# EasyEDA Pro project PCIE拆分卡.epro, board PCB1
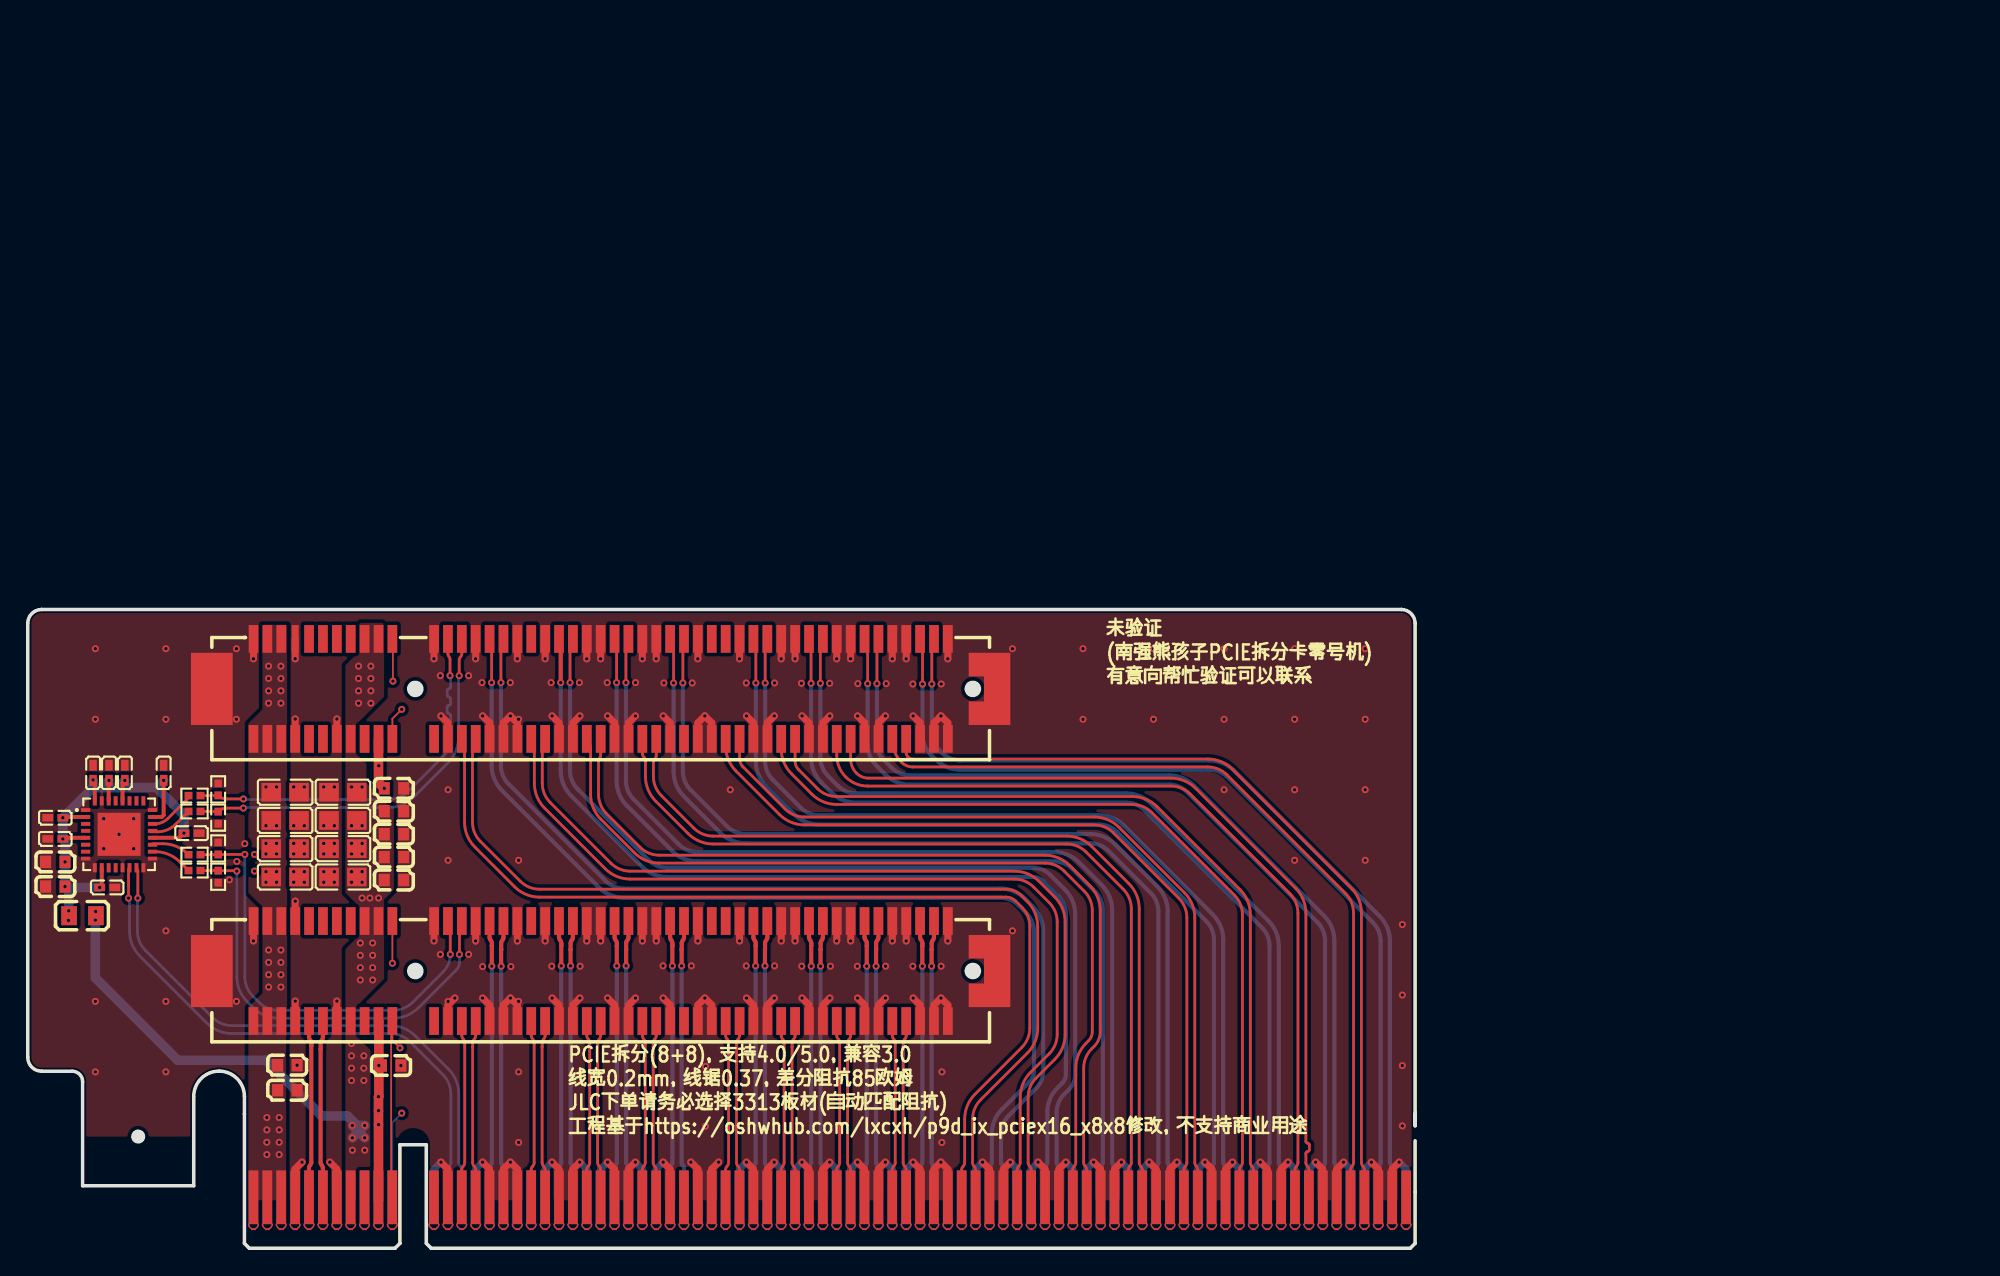
[diagram p4: board, top side]
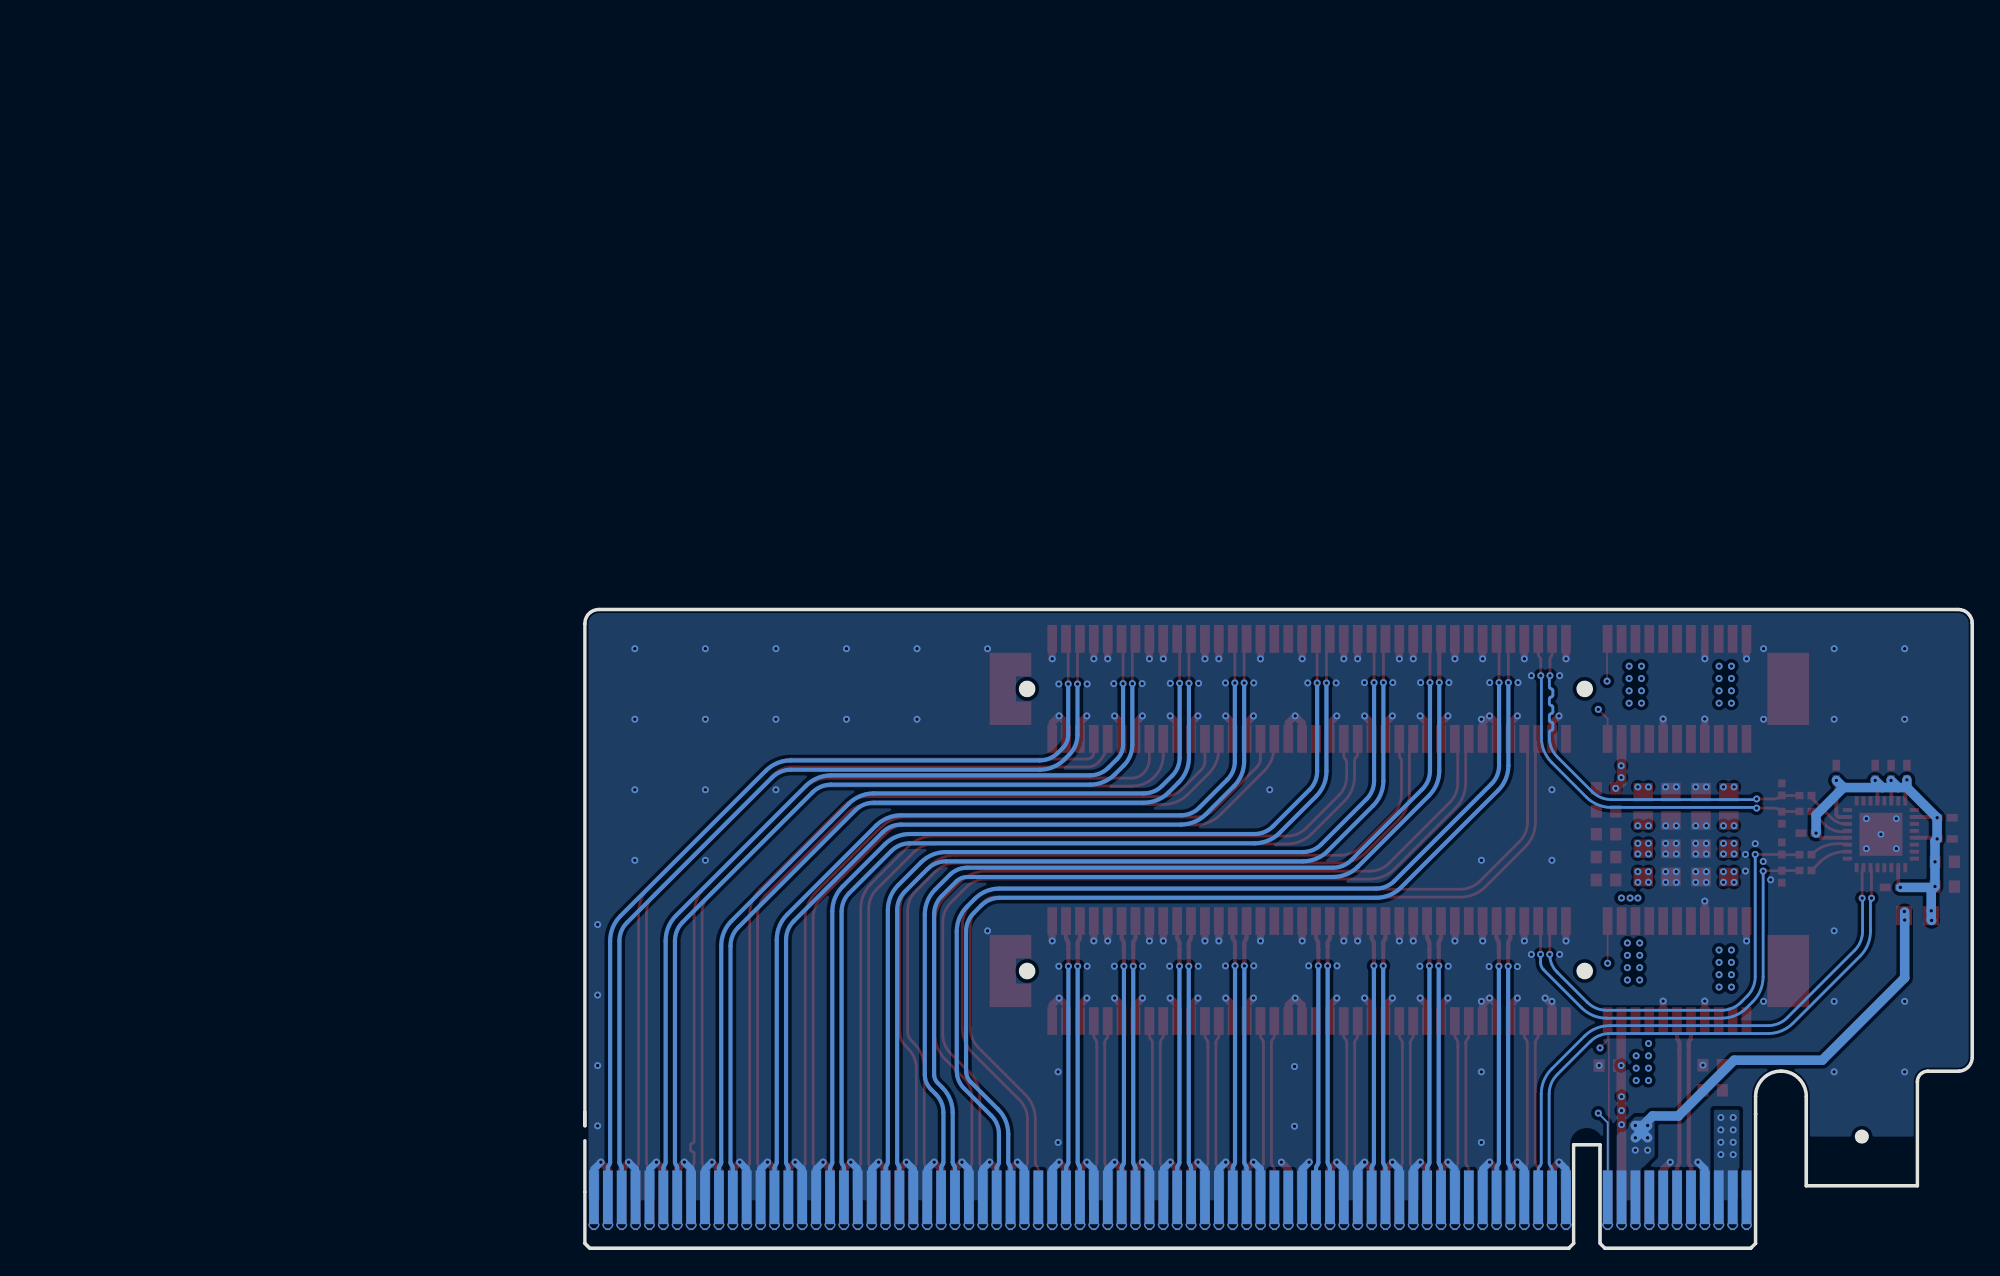
[diagram p5: board, bottom side, seen from below]

Outline 99.9 x 46.01 mm; copper layers: Top Layer, Inner1, Inner2, Bottom Layer. Coordinates in mm from the lower left corner of the outline.
Outline path: 15.6,10.93 arc(15.07,12.22) 13.78,12.76 arc(12.48,12.22) 11.95,10.93 11.95,4.5 3.95,4.5 3.95,12 arc(3.73,12.53) 3.2,12.75 1,12.75 arc(0.29,13.04) 0,13.75 0,45.01 arc(0.29,45.71) 1,46.01 98.9,46.01 arc(99.61,45.71) 99.9,45.01 99.9,8.82 99.9,9.77
Stack: Top Layer 0.035mm 外层铜厚1oz / Dielectric1 0.2104mm 7628 RC49% 8.6mil / Inner1 0.0152mm 内层铜厚 / Dielectric2 1.065mm 1.1mm H/HOZ 含铜 / Inner2 0.0152mm 内层铜厚 / Dielectric3 0.2104mm 7628 RC49% 8.6mil / Bottom Layer 0.035mm 外层铜厚1oz

## Design rules (mm)
net SMCLK: DP38
net SMDAT: DP38
net PE0_B0+: DP6
net PE0_B0-: DP6
net PE0_B1+: DP7
net PE0_B1-: DP7
net PE0_B2+: DP8
net PE0_B2-: DP8
net PE0_B3+: DP9
net PE0_B3-: DP9
net PE0_B4+: DP10
net PE0_B4-: DP10
net PE0_B5+: DP11
net PE0_B5-: DP11
net PE0_B6+: DP12
net PE0_B6-: DP12
net PE0_B7+: DP13
net PE0_B7-: DP13
net PE1_B0+: DP15
net PE1_B0-: DP15
net PE1_B1+: DP16
net PE1_B1-: DP16
net PE1_B2+: DP17
net PE1_B2-: DP17
net PE1_B3+: DP18
net PE1_B3-: DP18
net PE1_B4+: DP19
net PE1_B4-: DP19
net PE1_B5+: DP20
net PE1_B5-: DP20
net PE1_B6+: DP21
net PE1_B6-: DP21
net PE1_B7+: DP22
net PE1_B7-: DP22
net PE0_A3+: DP33
net PE0_A7-: DP37
net PE0_A6-: DP36
net PE0_A5-: DP35
net PE0_A5+: DP35
net PE0_A4+: DP34
net PE0_A4-: DP34
net PE0_A3-: DP33
net PE0_A7+: DP37
net PE0_A6+: DP36
net PE1_A0+: DP23
net PE0_A2+: DP32
net PE0_A2-: DP32
net PE0_A1-: DP31
net PE0_A1+: DP31
net REFCLK+: DP1
net REFCLK-: DP1
net PE0_A0-: DP14
net PE0_A0+: DP14
net PE1_A5-: DP28
net PE1_A5+: DP28
net PE1_A1-: DP24
net PE1_A0-: DP23
net PE1_A2+: DP25
net PE1_A2-: DP25
net PE1_A1+: DP24
net PE1_A3+: DP26
net PE1_A3-: DP26
net PE1_A4+: DP27
net PE1_A4-: DP27
net PE1_A6-: DP29
net PE1_A7-: DP30
net PE1_A7+: DP30
net PE1_A6+: DP29
net $2N1174: DP3
net $2N1173: DP3
net $2N1172: DP2
net PE1_CLK-: DP5
net PE1_CLK+: DP5
net PE0_CLK-: DP4
net PE0_CLK+: DP4
net $2N8038: DP2
template: 自定义配置
spacing copperThickness1oz (default): track to track 0.102, other pairs 0.152 to 0.3
spacing copperThickness2oz: track to track 0.203, other pairs 0.152 to 0.3
track width copperThickness1oz (default): min 0.127, default 0.254, max 2.54
track width copperThickness2oz: min 0.203, default 0.254, max 2.54
differential pair PCIE4.0 (default): width min 0.2, default 0.2, max 2.54; gap min 0.37, default 0.37
via viaSize (default): diameter min 0.508, default 0.508, max 10; hole min 0.254, default 0.254, max 6.299

## Placement (name value [footprint] x y rotation side)
C40  22uF  [C0805]  18.53 26.74 0 top
C41  22uF  [C0805]  18.53 28.78 0 top
C45  22uF  [C0805]  22.7 30.81 180 top
C46  22uF  [C0805]  22.7 32.84 180 top
C53  1uF  [C0603]  1.98 27.83 180 top
C54  10uF  [C0603]  1.98 26.05 180 top
C67  100nF  [C0402]  11.79 29.9 0 top
C68  100nF  [C0402]  1.98 29.48 180 top
C69  100nF  [C0402]  5.85 34.24 90 top
C70  100nF  [C0402]  4.7 34.24 270 top
C71  100nF  [C0402]  1.98 31 0 top
C72  100nF  [C0402]  9.78 34.24 90 top
C73  100nF  [C0402]  5.72 25.99 180 top
C74  100nF  [C0402]  6.99 34.24 270 top
C77  100nF  [C0603]  26.37 28.17 0 top
C78  100nF  [C0603]  26.37 31.47 0 top
C79  100nF  [C0603]  26.37 33.12 0 top
C80  22uF  [C0805]  18.53 30.81 0 top
C81  22uF  [C0805]  18.53 32.84 0 top
C82  22uF  [C0805]  22.7 28.78 180 top
C83  22uF  [C0805]  22.7 26.74 180 top
C84  100nF  [C0603]  18.69 11.38 0 top
C85  100nF  [C0603]  18.69 13.18 0 top
C86  100nF  [C0603]  26.37 29.82 0 top
C87  100nF  [C0603]  26.37 26.52 0 top
C88  100nF  [C0603]  26.17 13.16 0 top
CEMX16_GOLD1  -  [PCIEX16_GOLD]  83.57 47.45 0 top
CN4  3113-112T  [CONN-SMD_98P-P1.00-V_3133]  41.25 19.97 0 top
CN5  3113-112T  [conn-smd_98p-p1.00-v_3133]  41.25 40.29 0 top
L3  -  [L0805]  3.94 23.95 0 top
R37  49.9Ω  [R0402]  13.71 33.05 270 top
R38  49.9Ω  [R0402]  13.71 31.01 90 top
R39  49.9Ω  [R0402]  13.71 28.79 270 top
R40  49.9Ω  [R0402]  13.71 26.76 90 top
R45  33Ω  [R0402]  12.01 32.6 0 top
R46  33Ω  [R0402]  12.01 31.46 0 top
R47  33Ω  [R0402]  12.01 28.35 0 top
R48  33Ω  [R0402]  12.01 27.2 0 top
U1  -  [WQFN-32_L5.0-W5.0-P0.50-BL-EP]  6.58 29.81 270 top

## Footprints (pads in the part's own frame, mm; a bottom-side part is the same pattern mirrored in y, then rotated)
C0402
  rect 0.79x0.54 smd: 1(-0.545,0) 2(0.545,0)
C0603
  rect 0.8x0.9 smd: 1(-0.7,0) 2(0.7,0)
C0805
  rect 1.41x1.35 smd: 1(-1,0) 2(1,0)
CONN-SMD_98P-P1.00-V_3133
  rect 3x5.2 smd: 50(-28,0)
  custom 3x5.2 smd: 52(28.55,0)
  rect 0.7x2 smd: A1(-25,3.6) A2(-24,3.6) A3(-23,3.6) A4(-22,3.6) A5(-21,3.6) A6(-20,3.6) A7(-19,3.6) A8(-18,3.6) A9(-17,3.6) A10(-16,3.6) A11(-15,3.6) A12(-12,3.6) A13(-11,3.6) A14(-10,3.6) A15(-9,3.6) A16(-8,3.6) A17(-7,3.6) A18(-6,3.6) A19(-5,3.6) A20(-4,3.6) A21(-3,3.6) A22(-2,3.6) A23(-1,3.6) A24(0,3.6) A25(1,3.6) A26(2,3.6) A27(3,3.6) A28(4,3.6) A29(5,3.6) A30(6,3.6) A31(7,3.6) A32(8,3.6) A33(9,3.6) A34(10,3.6) A35(11,3.6) A36(12,3.6) A37(13,3.6) A38(14,3.6) A39(15,3.6) A40(16,3.6) A41(17,3.6) A42(18,3.6) A43(19,3.6) A44(20,3.6) A45(21,3.6) A46(22,3.6) A47(23,3.6) A48(24,3.6) A49(25,3.6) B1(-25,-3.6) B2(-24,-3.6) B3(-23,-3.6) B4(-22,-3.6) B5(-21,-3.6) B6(-20,-3.6) B7(-19,-3.6) B8(-18,-3.6) B9(-17,-3.6) B10(-16,-3.6) B11(-15,-3.6) B12(-12,-3.6) B13(-11,-3.6) B14(-10,-3.6) B15(-9,-3.6) B16(-8,-3.6) B17(-7,-3.6) B18(-6,-3.6) B19(-5,-3.6) B20(-4,-3.6) B21(-3,-3.6) B22(-2,-3.6) B23(-1,-3.6) B24(0,-3.6) B25(1,-3.6) B26(2,-3.6) B27(3,-3.6) B28(4,-3.6) B29(5,-3.6) B30(6,-3.6) B31(7,-3.6) B32(8,-3.6) B33(9,-3.6) B34(10,-3.6) B35(11,-3.6) B36(12,-3.6) B37(13,-3.6) B38(14,-3.6) B39(15,-3.6) B40(16,-3.6) B41(17,-3.6) B42(18,-3.6) B43(19,-3.6) B44(20,-3.6) B45(21,-3.6) B46(22,-3.6) B47(23,-3.6) B48(24,-3.6) B49(25,-3.6)
conn-smd_98p-p1.00-v_3133
  rect 3x5.2 smd: 50(-28,0)
  custom 3x5.2 smd: 52(28.55,0)
  rect 0.7x2 smd: A1(-25,3.6) A2(-24,3.6) A3(-23,3.6) A5(-21,3.6) A6(-20,3.6) A7(-19,3.6) A8(-18,3.6) A9(-17,3.6) A10(-16,3.6) A11(-15,3.6) A12(-12,3.6) A13(-11,3.6) A14(-10,3.6) A15(-9,3.6) A16(-8,3.6) A17(-7,3.6) A18(-6,3.6) A19(-5,3.6) A20(-4,3.6) A21(-3,3.6) A22(-2,3.6) A23(-1,3.6) A24(0,3.6) A25(1,3.6) A26(2,3.6) A27(3,3.6) A28(4,3.6) A29(5,3.6) A30(6,3.6) A31(7,3.6) A32(8,3.6) A33(9,3.6) A34(10,3.6) A35(11,3.6) A36(12,3.6) A37(13,3.6) A38(14,3.6) A39(15,3.6) A40(16,3.6) A41(17,3.6) A42(18,3.6) A43(19,3.6) A44(20,3.6) A45(21,3.6) A46(22,3.6) A47(23,3.6) A48(24,3.6) A49(25,3.6) B1(-25,-3.6) B2(-24,-3.6) B3(-23,-3.6) B4(-22,-3.6) B5(-21,-3.6) B6(-20,-3.6) B7(-19,-3.6) B8(-18,-3.6) B9(-17,-3.6) B10(-16,-3.6) B11(-15,-3.6) B12(-12,-3.6) B13(-11,-3.6) B14(-10,-3.6) B15(-9,-3.6) B16(-8,-3.6) B17(-7,-3.6) B18(-6,-3.6) B19(-5,-3.6) B20(-4,-3.6) B21(-3,-3.6) B22(-2,-3.6) B23(-1,-3.6) B24(0,-3.6) B25(1,-3.6) B26(2,-3.6) B27(3,-3.6) B28(4,-3.6) B29(5,-3.6) B30(6,-3.6) B31(7,-3.6) B32(8,-3.6) B33(9,-3.6) B34(10,-3.6) B35(11,-3.6) B36(12,-3.6) B37(13,-3.6) B38(14,-3.6) B39(15,-3.6) B40(16,-3.6) B41(17,-3.6) B42(18,-3.6) B43(19,-3.6) B44(20,-3.6) B45(21,-3.6) B46(22,-3.6) B47(23,-3.6) B48(24,-3.6) B49(25,-3.6)
  rect 0.508x2 smd: A4(-22,3.6)
L0805
  rect 1.133x1.377 smd: 1(-0.966,0) 2(0.966,0)
PCIEX16_GOLD
  custom 0.7x4.29 smd far side: A1(-67.321,-43.993) A2(-66.321,-43.993) A3(-65.321,-43.993) A4(-64.321,-43.993) A5(-63.321,-43.993) A6(-62.321,-43.993) A7(-61.321,-43.993) A8(-60.321,-43.993) A9(-59.321,-43.993) A10(-58.321,-43.993) A11(-57.321,-43.993) A12(-54.321,-43.993) A13(-53.321,-43.993) A14(-52.321,-43.993) A15(-51.321,-43.993) A16(-50.321,-43.993) A17(-49.321,-43.993) A18(-48.321,-43.993) A19(-47.321,-43.993) A20(-46.321,-43.993) A21(-45.321,-43.993) A22(-44.321,-43.993) A23(-43.321,-43.993) A24(-42.321,-43.993) A25(-41.321,-43.993) A26(-40.321,-43.993) A27(-39.321,-43.993) A28(-38.321,-43.993) A29(-37.321,-43.993) A30(-36.321,-43.993) A31(-35.321,-43.993) A32(-34.321,-43.993) A33(-33.321,-43.993) A34(-32.321,-43.993) A35(-31.321,-43.993) A36(-30.321,-43.993) A37(-29.321,-43.993) A38(-28.321,-43.993) A39(-27.321,-43.993) A40(-26.321,-43.993) A41(-25.321,-43.993) A42(-24.321,-43.993) A43(-23.321,-43.993) A44(-22.321,-43.993) A45(-21.321,-43.993) A46(-20.321,-43.993) A47(-19.321,-43.993) A48(-18.321,-43.993) A49(-17.321,-43.993) A50(-16.321,-43.993) A51(-15.321,-43.993) A52(-14.321,-43.993) A53(-13.321,-43.993) A54(-12.321,-43.993) A55(-11.321,-43.993) A56(-10.321,-43.993) A57(-9.321,-43.993) A58(-8.321,-43.993) A59(-7.321,-43.993) A60(-6.321,-43.993) A61(-5.321,-43.993) A62(-4.321,-43.993) A63(-3.321,-43.993) A64(-2.321,-43.993) A65(-1.321,-43.993) A66(-0.321,-43.993) A67(0.679,-43.993) A68(1.679,-43.993) A69(2.679,-43.993) A70(3.679,-43.993) A71(4.679,-43.993) A72(5.679,-43.993) A73(6.679,-43.993) A74(7.679,-43.993) A75(8.679,-43.993) A76(9.679,-43.993) A77(10.679,-43.993) A78(11.679,-43.993) A79(12.679,-43.993) A80(13.679,-43.993) A81(14.679,-43.993) A82(15.679,-43.993)
  custom 0.7x4.29 smd: B1(-67.321,-43.993) B2(-66.321,-43.993) B3(-65.321,-43.993) B4(-64.321,-43.993) B5(-63.321,-43.993) B6(-62.321,-43.993) B7(-61.321,-43.993) B8(-60.321,-43.993) B9(-59.321,-43.993) B10(-58.321,-43.993) B11(-57.321,-43.993) B12(-54.321,-43.993) B13(-53.321,-43.993) B14(-52.321,-43.993) B15(-51.321,-43.993) B16(-50.321,-43.993) B17(-49.321,-43.993) B18(-48.321,-43.993) B19(-47.321,-43.993) B20(-46.321,-43.993) B21(-45.321,-43.993) B22(-44.321,-43.993) B23(-43.321,-43.993) B24(-42.321,-43.993) B25(-41.321,-43.993) B26(-40.321,-43.993) B27(-39.321,-43.993) B28(-38.321,-43.993) B29(-37.321,-43.993) B30(-36.321,-43.993) B31(-35.321,-43.993) B32(-34.321,-43.993) B33(-33.321,-43.993) B34(-32.321,-43.993) B35(-31.321,-43.993) B36(-30.321,-43.993) B37(-29.321,-43.993) B38(-28.321,-43.993) B39(-27.321,-43.993) B40(-26.321,-43.993) B41(-25.321,-43.993) B42(-24.321,-43.993) B43(-23.321,-43.993) B44(-22.321,-43.993) B45(-21.321,-43.993) B46(-20.321,-43.993) B47(-19.321,-43.993) B48(-18.321,-43.993) B49(-17.321,-43.993) B50(-16.321,-43.993) B51(-15.321,-43.993) B52(-14.321,-43.993) B53(-13.321,-43.993) B54(-12.321,-43.993) B55(-11.321,-43.993) B56(-10.321,-43.993) B57(-9.321,-43.993) B58(-8.321,-43.993) B59(-7.321,-43.993) B60(-6.321,-43.993) B61(-5.321,-43.993) B62(-4.321,-43.993) B63(-3.321,-43.993) B64(-2.321,-43.993) B65(-1.321,-43.993) B66(-0.321,-43.993) B67(0.679,-43.993) B68(1.679,-43.993) B69(2.679,-43.993) B70(3.679,-43.993) B71(4.679,-43.993) B72(5.679,-43.993) B73(6.679,-43.993) B74(7.679,-43.993) B75(8.679,-43.993) B76(9.679,-43.993) B77(10.679,-43.993) B78(11.679,-43.993) B79(12.679,-43.993) B80(13.679,-43.993) B81(14.679,-43.993) B82(15.679,-43.993)
R0402
  rect 0.566x0.54 smd: 1(-0.433,0) 2(0.433,0)
WQFN-32_L5.0-W5.0-P0.50-BL-EP
  rect 0.28x0.665 smd: 1(-1.75,-2.408) 2(-1.25,-2.408) 3(-0.75,-2.408) 4(-0.249,-2.408) 5(0.249,-2.408) 6(0.75,-2.408) 7(1.25,-2.408) 8(1.75,-2.408) 17(1.75,2.408) 18(1.25,2.408) 19(0.75,2.408) 20(0.249,2.408) 21(-0.249,2.408) 22(-0.75,2.408) 23(-1.25,2.408) 24(-1.75,2.408)
  rect 0.665x0.28 smd: 9(2.408,-1.75) 10(2.408,-1.25) 11(2.408,-0.75) 12(2.408,-0.249) 13(2.408,0.249) 14(2.408,0.75) 15(2.408,1.25) 16(2.408,1.75) 25(-2.408,1.75) 26(-2.408,1.25) 27(-2.408,0.75) 28(-2.408,0.249) 29(-2.408,-0.249) 30(-2.408,-0.75) 31(-2.408,-1.25) 32(-2.408,-1.75)
  rect 3.099x3.099 smd: 33(0,0)

## Nets
As in the schematic.

Pads without a net: CEMX16_GOLD1 A5 A6 A7 A8 A19 A32 A33 A50 B9 B12 B30 B82; CN4 A5 A6 A7 A8 A19 A32 A33 B9 B12 B30; CN5 A5 A6 A7 A8 A19 A32 A33 B5 B6 B9 B12 B30; U1 3 4 6 7 11 12 25 26 27 29

## Via types
v1: diameter 0.508, hole 0.254, Top Layer to Bottom Layer, 376 vias

## Routing (per net, layer and track width the routed paths; a pad name or vN(x,y) marks a point on that pad's centre or on a via; arc(x,y) is an arc through that point)
GND: length 346.8
  Top Layer w0.508: 85.26,3.46 85.26,5.7 v1(84.76,6.2) ; CN5.A42 59.25,42.46 ; CEMX16_GOLD1.B61 78.25,5.7 v1(78.75,6.2) ; CEMX16_GOLD1.B73 90.25,5.7 v1(90.75,6.2) ; CN4.A34 51.25,22.14 ; v1(19.75,6.2) 19.25,5.7 CEMX16_GOLD1.A4 ; CEMX16_GOLD1.B25 42.25,5.7 v1(41.75,6.2) ; CN5.B21 38.25,37.84 v1(37.75,38.34) ; CEMX16_GOLD1.B53 70.25,5.7 v1(70.75,6.2) ; CN5.B13 30.25,37.84 v1(29.75,38.34) ; CN5.B49 66.25,37.84 v1(65.75,38.34) 65.25,37.84 CN5.B48 ; CN4.B44 61.25,17.52 v1(61.75,18.02) ; CEMX16_GOLD1.B81 98.25,5.7 v1(98.75,6.2) ; CN5.A37 54.25,42.46 ; CEMX16_GOLD1.B69 86.25,5.7 v1(86.75,6.2) ; CN4.B48 65.25,17.52 v1(65.75,18.02) 66.25,17.52 CN4.B49 ; CN5.B43 60.25,37.84 v1(59.75,38.34) ; CEMX16_GOLD1.B32 49.25,5.7 v1(49.75,6.2) ; CEMX16_GOLD1.B80 97.25,5.7 v1(96.75,6.2) ; CN4.A49 66.25,22.14 ; v1(80.75,6.2) 81.25,5.7 CEMX16_GOLD1.B64 ; CN5.B25 42.25,37.84 v1(41.75,38.34) ; CN5.B17 34.25,37.84 v1(34.75,38.34) 35.25,37.84 CN5.B18 ; CN5.A31 48.25,42.46 ; CEMX16_GOLD1.B56 73.25,5.7 v1(72.75,6.2) ; CN4.B16 33.25,17.52 v1(32.75,18.02) ; CN5.B29 46.25,37.84 v1(45.75,38.34) ; v1(74.75,6.2) 74.25,5.7 CEMX16_GOLD1.B57 ; CEMX16_GOLD1.B60 77.25,5.7 v1(76.75,6.2) ; CN5.A4 v1(19.25,42.46) ; CN5.A12 29.25,42.46 ; v1(61.75,6.2) 61.25,5.7 CEMX16_GOLD1.B44 ; v1(55.75,38.34) 56.25,37.84 CN5.B39 ; CN5.B4 19.25,38.11 ; v1(45.75,6.2) 46.25,5.7 CEMX16_GOLD1.B29 ; CN4.B21 38.25,17.52 v1(37.75,18.02) ; CN5.B32 49.25,37.84 v1(48.75,38.34) 48.25,37.84 CN5.B31 ; CN4.B22 39.25,17.52 v1(39.75,18.02) ; CEMX16_GOLD1.B65 82.25,5.7 v1(82.75,6.2) ; CEMX16_GOLD1.B35 52.25,5.7 v1(51.75,6.2) ; CN4.A1 16.25,22.14 ; v1(61.75,38.34) 61.25,37.84 CN5.B44 ; CEMX16_GOLD1.B13 30.25,5.7 v1(29.75,6.2) ; v1(43.75,18.02) 43.25,17.52 CN4.B26 ; CN4.B43 60.25,17.52 v1(59.75,18.02) ; CN4.B18 35.25,17.52 v1(34.75,18.02) 34.25,17.52 CN4.B17 ; CN4.B4 19.25,17.79 ; v1(92.74,6.2) 93.24,5.7 93.24,3.46 ; v1(32.75,6.2) 33.25,5.7 CEMX16_GOLD1.B16 ; v1(94.75,6.2) 94.25,5.7 CEMX16_GOLD1.B77 ; v1(32.75,38.34) 33.25,37.84 CN5.B16 ; CN5.B7 22.25,38.11 ; v1(43.75,38.34) 43.25,37.84 CN5.B26 ; v1(30.75,18.02) 30.25,17.52 CN4.B13 ; v1(47.75,6.2) 48.25,5.7 CEMX16_GOLD1.A31 ; v1(63.75,18.02) 64.25,17.52 CN4.B47 ; CN5.A28 45.25,42.46 ; CEMX16_GOLD1.B40 57.25,5.7 v1(57.75,6.2) ; CN5.B36 53.25,37.84 v1(53.75,38.34) ; v1(37.75,6.2) 38.25,5.7 CEMX16_GOLD1.B21 ; CN4.A42 59.25,22.14 ; CN4.A38 55.25,22.14 ; CN4.A46 63.25,22.14 ; v1(63.75,38.34) 64.25,37.84 CN5.B47 ; CEMX16_GOLD1.A49 66.25,5.7 v1(65.75,6.2) 65.25,5.7 CEMX16_GOLD1.B48 ; v1(59.75,6.2) 60.25,5.7 CEMX16_GOLD1.B43 ; v1(45.75,18.02) 46.25,17.52 CN4.B29 ; CEMX16_GOLD1.B17 34.25,5.7 v1(34.75,6.2) 35.25,5.7 CEMX16_GOLD1.A18 ; v1(39.75,38.34) 39.25,37.84 CN5.B22 ; CN4.A20 37.25,22.14 ; v1(88.75,6.2) 89.25,5.7 CEMX16_GOLD1.B72 ; CEMX16_GOLD1.B39 56.25,5.7 v1(55.75,6.2) ; v1(57.75,18.02) 57.25,17.52 CN4.B40 ; CN4.A27 44.25,22.14 ; v1(39.75,6.2) 39.25,5.7 CEMX16_GOLD1.B22 ; CN5.A18 35.25,42.46 ; CN4.A24 41.25,22.14 ; v1(63.75,6.2) 64.25,5.7 CEMX16_GOLD1.B47 ; CN4.B39 56.25,17.52 v1(55.75,18.02) ; CN5.A15 32.25,42.46 ; CN5.B35 52.25,37.84 v1(51.75,38.34) ; CN4.A23 40.25,22.14 ; v1(41.75,18.02) 42.25,17.52 CN4.B25 ; CEMX16_GOLD1.B52 69.25,5.7 v1(68.75,6.2) ; CN4.B32 49.25,17.52 v1(48.75,18.02) 48.25,17.52 CN4.B31 ; CEMX16_GOLD1.B36 53.25,5.7 v1(53.75,6.2) ; CN4.A15 32.25,22.14 ; CN5.A34 51.25,42.46 ; CN5.A38 55.25,42.46 ; CN4.B35 52.25,17.52 v1(51.75,18.02) ; CN4.A45 62.25,22.14 ; CN5.A49 66.25,42.46 ; CN5.A20 37.25,42.46 ; CN4.A18 35.25,22.14 ; CN5.A41 58.25,42.46 ; v1(57.75,38.34) 57.25,37.84 CN5.B40 ; v1(43.75,6.2) 43.25,5.7 CEMX16_GOLD1.B26 ; v1(21.75,6.2) 22.25,5.7 CEMX16_GOLD1.B7 ; CN4.B7 22.25,17.79 ; CN5.A46 63.25,42.46 ; CN4.A31 48.25,22.14 ; CN4.A4 19.25,24.99 ; CN5.A45 62.25,42.46 ; CN5.A24 41.25,42.46 ; CN4.A41 58.25,22.14 ; CN5.A27 44.25,42.46 ; CN4.A28 45.25,22.14 ; CN4.B36 53.25,17.52 v1(53.75,18.02) ; CN5.A23 40.25,42.46 ; CN4.A12 29.25,22.14 ; CN4.A37 54.25,22.14 ; CN5.A1 16.25,42.46
  Bottom Layer w0.508: CEMX16_GOLD1.A62 79.25,5.7 v1(78.75,6.2) ; v1(59.75,6.2) 59.25,5.7 CEMX16_GOLD1.A42 ; v1(80.75,6.2) 80.25,5.7 CEMX16_GOLD1.A63 ; v1(70.75,6.2) 71.25,5.7 CEMX16_GOLD1.A54 ; v1(55.75,6.2) 55.25,5.7 CEMX16_GOLD1.A38 ; v1(90.75,6.2) 91.25,5.7 CEMX16_GOLD1.A74 ; CEMX16_GOLD1.A49 66.25,5.7 v1(65.75,6.2) ; v1(29.75,6.2) 29.25,5.7 CEMX16_GOLD1.A12 ; CEMX16_GOLD1.A82 99.25,5.7 v1(98.75,6.2) ; v1(32.75,6.2) 32.25,5.7 CEMX16_GOLD1.A15 ; 92.75,6.2 92.25,5.7 CEMX16_GOLD1.A75 ; CEMX16_GOLD1.A18 35.25,5.7 v1(34.75,6.2) ; CEMX16_GOLD1.A66 83.25,5.7 v1(82.75,6.2) ; v1(47.75,6.2) 48.25,5.7 CEMX16_GOLD1.A31 ; CEMX16_GOLD1.A34 51.25,5.7 v1(51.75,6.2) ; CEMX16_GOLD1.A79 96.25,5.7 v1(96.75,6.2) ; CEMX16_GOLD1.A45 62.25,5.7 v1(61.75,6.2) ; CEMX16_GOLD1.A51 68.25,5.7 v1(68.75,6.2) ; CEMX16_GOLD1.A46 63.25,5.7 v1(63.75,6.2) ; v1(86.75,6.2) 87.25,5.7 CEMX16_GOLD1.A70 ; CEMX16_GOLD1.A27 44.25,5.7 v1(43.75,6.2) ; v1(74.75,6.2) 75.25,5.7 CEMX16_GOLD1.A58 ; v1(45.75,6.2) 45.25,5.7 CEMX16_GOLD1.A28 ; CEMX16_GOLD1.A59 76.25,5.7 v1(76.75,6.2) ; 84.75,6.2 84.25,5.7 CEMX16_GOLD1.A67 ; v1(37.75,6.2) 37.25,5.7 CEMX16_GOLD1.A20 ; v1(94.75,6.2) 95.25,5.7 CEMX16_GOLD1.A78 ; CEMX16_GOLD1.A55 72.25,5.7 v1(72.75,6.2) ; CEMX16_GOLD1.A4 19.25,5.7 v1(19.75,6.2) ; CEMX16_GOLD1.A71 88.25,5.7 v1(88.75,6.2) ; CEMX16_GOLD1.A41 58.25,5.7 v1(57.75,6.2) ; CEMX16_GOLD1.A37 54.25,5.7 v1(53.75,6.2) ; v1(41.75,6.2) 41.25,5.7 CEMX16_GOLD1.A24 ; CEMX16_GOLD1.A23 40.25,5.7 v1(39.75,6.2)
  vias: v1(4.86,43.18) v1(4.86,38.1) v1(4.86,17.78) v1(4.86,12.7) v1(5.47,30.94) v1(5.47,28.78) v1(6.58,29.81) v1(7.63,30.94) v1(7.63,28.78) v1(9.94,43.18) v1(9.94,38.1) v1(9.94,22.86) v1(9.94,17.78) v1(9.94,12.7) v1(14.52,26.53) v1(15.02,43.18) v1(15.02,38.1) v1(15.05,27.86) v1(15.02,17.78) v1(15.63,29.14) v1(16.25,42.45) v1(16.25,22.13) v1(16.33,28.36) v1(16.33,27.16) v1(19.15,33.22) v1(19.15,30.43) v1(19.15,29.16) v1(19.15,28.4) v1(19.15,27.12) v1(19.15,26.36) v1(19.26,38.12) v1(19.26,25) v1(19.26,17.8) v1(19.39,13.18) v1(19.91,33.22) v1(19.91,30.43) v1(19.91,29.16) v1(19.91,28.4) v1(19.91,27.12) v1(19.91,26.36) v1(21.31,33.22) v1(21.31,30.43) v1(21.31,29.16) v1(21.31,28.4) v1(21.31,27.12) v1(21.31,26.36) v1(22.08,33.22) v1(22.08,30.43) v1(22.08,29.16) v1(22.08,28.4) v1(22.08,27.12) v1(22.08,26.36) v1(22.26,38.12) v1(22.26,17.8) v1(26.87,13.16) v1(29.25,42.45) v1(29.25,22.13) v1(29.71,41.24) v1(29.71,21.16) v1(30.26,33.02) v1(30.26,27.94) v1(30.26,17.78) v1(31.75,41.24) v1(31.75,21.16) v1(32.25,42.45) v1(32.25,22.13) v1(32.71,40.74) v1(32.75,20.29) v1(34.75,40.74) v1(34.79,20.29) v1(35.25,42.45) v1(35.25,22.13) v1(35.34,38.1) v1(35.34,27.94) v1(35.34,17.78) v1(35.34,12.7) v1(35.34,7.62) v1(37.25,42.45) v1(37.25,22.13) v1(37.68,40.74) v1(37.73,20.31) v1(39.72,40.74) v1(39.77,20.31) v1(40.25,42.45) v1(40.25,22.13) v1(41.25,42.45) v1(41.25,22.13) v1(41.73,40.74) v1(43.76,40.74) v1(44.25,42.45) v1(44.25,22.13) v1(45.25,42.45) v1(45.25,22.13) v1(45.81,40.71) v1(45.74,20.34) v1(47.78,20.34) v1(47.85,40.71) v1(48.25,42.45) v1(48.25,22.13) v1(48.8,13.09) v1(48.8,8.79) v1(50.58,33.02) v1(51.25,42.45) v1(51.25,22.13) v1(51.73,40.71) v1(51.73,20.34) v1(53.77,40.71) v1(53.77,20.34) v1(54.25,42.45) v1(54.25,22.13) v1(55.25,42.45) v1(55.25,22.13) v1(55.71,40.69) v1(55.73,20.31) v1(57.75,40.69) v1(57.8,20.31) v1(58.25,42.45) v1(58.25,22.13) v1(59.25,42.45) v1(59.25,22.13) v1(59.78,40.66) v1(59.73,20.31) v1(61.81,40.66) v1(61.77,20.31) v1(62.25,42.45) v1(62.25,22.13) v1(63.25,42.45) v1(63.25,22.13) v1(63.73,40.64) v1(63.73,20.31) v1(65.77,40.64) v1(65.77,20.31) v1(65.82,12.7) v1(65.82,7.62) v1(66.25,42.45) v1(66.25,22.13) v1(70.9,43.18) v1(70.9,22.86) v1(75.98,43.18) v1(75.98,38.1) v1(81.06,43.18) v1(81.06,38.1) v1(86.14,43.18) v1(86.14,38.1) v1(86.14,33.02) v1(91.22,43.18) v1(91.22,38.1) v1(91.22,33.02) v1(91.22,27.94) v1(96.3,43.18) v1(96.3,38.1) v1(96.3,33.02) v1(96.3,27.94) v1(98.98,23.31) v1(98.98,18.23) v1(98.98,13.15) v1(98.98,8.81)
P3V3_1: length 31.1
  Bottom Layer w0.686: 23.82,8.4 v1(23.37,8.84) ; 23.82,8.4 v1(24.26,7.95) ; 23.82,8.4 v1(24.26,8.84) 23.71,8.84 23.02,9.53 21.16,9.53 17.15,13.54 10.8,13.54 4.86,19.48 v1(4.86,23.64) 4.86,24.23 ; 23.82,8.4 v1(23.37,7.95)
  vias: v1(4.89,24.25) v1(23.31,33.22) v1(23.31,30.43) v1(23.31,29.16) v1(23.31,28.4) v1(23.31,27.12) v1(23.31,26.36) v1(23.31,14.75) v1(23.31,13.86) v1(23.31,12.97) v1(23.31,12.08) v1(23.37,7.06) v1(23.82,41.92) v1(23.82,41.04) v1(23.82,40.15) v1(23.82,39.26) v1(23.94,21.99) v1(23.94,21.1) v1(23.94,20.21) v1(23.94,19.32) v1(24.08,33.22) v1(24.08,30.43) v1(24.08,29.16) v1(24.08,28.4) v1(24.08,27.12) v1(24.08,26.36) v1(24.07,25.22) v1(24.2,13.86) v1(24.2,12.97) v1(24.2,12.08) v1(24.26,7.06) v1(24.71,41.92) v1(24.71,41.04) v1(24.71,40.15) v1(24.71,39.26) v1(24.64,25.22) v1(24.83,21.99) v1(24.83,21.1) v1(24.83,20.21) v1(24.83,19.32) v1(25.26,25.22)
P3V3AUX: length 47.8
  Top Layer w0.686: v1(25.67,33.12) 25.25,33.54 CN5.B10 ; CEMX16_GOLD1.B10 25.25,3.46 v1(25.25,8.9) v1(25.25,9.91) v1(25.25,10.92) 25.28,10.94 v1(25.28,13.16) 25.28,16.34 CN4.B10
  Inner1 w0.686: v1(25.25,8.9) v1(25.25,9.91) v1(25.25,10.92) 25.28,10.94 v1(25.28,13.16) 25.28,17.6 26.4,18.72 28.46,18.72 29.15,19.41 29.15,20.6 28.46,21.29 27.06,21.29 26.36,21.99 26.36,32.44 v1(25.67,33.12) 25.28,33.52 v1(25.28,33.9) v1(25.28,34.75)
P12V:
  vias: v1(17.15,33.22) v1(17.15,30.43) v1(17.15,29.16) v1(17.15,28.4) v1(17.15,27.12) v1(17.15,26.36) v1(17.21,9.41) v1(17.21,8.52) v1(17.21,7.63) v1(17.21,6.75) v1(17.34,41.92) v1(17.34,41.04) v1(17.34,40.15) v1(17.34,39.26) v1(17.34,21.48) v1(17.34,20.59) v1(17.34,19.7) v1(17.34,18.81) v1(17.91,33.22) v1(17.91,30.43) v1(17.91,29.16) v1(17.91,28.4) v1(17.91,27.12) v1(17.91,26.36) v1(18.1,9.41) v1(18.1,8.52) v1(18.1,7.63) v1(18.1,6.75) v1(18.23,41.92) v1(18.23,41.04) v1(18.23,40.15) v1(18.23,39.26) v1(18.23,21.48) v1(18.23,20.59) v1(18.23,19.7) v1(18.23,18.81)
PE0_A0+: length 20.2
  Top Layer w0.299: CN4.A16 33.25,22.38 arc(33.28,22.28) 33.34,22.18 arc(33.4,22.09) 33.42,21.98 33.42,21.8 arc(33.42,21.8) 33.42,21.8 arc(33.42,21.8) 33.42,21.79 v1(33.42,20.31)
  Bottom Layer w0.299: CEMX16_GOLD1.A16 33.25,5.78 arc(33.27,5.89) 33.33,5.98 arc(33.39,6.07) 33.42,6.18 v1(33.42,20.31)
PE0_A0-: length 20.2
  Top Layer w0.299: v1(34.09,20.31) 34.09,21.52 arc(34.09,21.52) 34.09,21.52 arc(34.09,21.52) 34.09,21.53 34.09,21.98 arc(34.11,22.09) 34.17,22.18 arc(34.23,22.28) 34.25,22.38 CN4.A17
  Bottom Layer w0.299: CEMX16_GOLD1.A17 34.25,5.78 arc(34.23,5.89) 34.17,5.98 arc(34.11,6.07) 34.09,6.18 v1(34.09,20.31)
PE0_A1+: length 20.2
  Top Layer w0.299: CN4.A21 38.25,22.38 arc(38.28,22.28) 38.34,22.18 arc(38.4,22.09) 38.42,21.98 38.42,21.8 arc(38.42,21.8) 38.42,21.8 arc(38.42,21.8) 38.42,21.79 v1(38.42,20.34)
  Bottom Layer w0.299: v1(38.42,20.34) 38.42,6.18 arc(38.39,6.07) 38.33,5.98 arc(38.27,5.89) 38.25,5.78 CEMX16_GOLD1.A21
PE0_A1-: length 20.2
  Top Layer w0.299: CN4.A22 39.25,22.38 arc(39.23,22.28) 39.17,22.18 arc(39.11,22.09) 39.09,21.98 39.09,21.53 arc(39.09,21.52) 39.09,21.52 arc(39.09,21.52) 39.09,21.52 v1(39.09,20.34)
  Bottom Layer w0.299: CEMX16_GOLD1.A22 39.25,5.78 arc(39.23,5.89) 39.17,5.98 arc(39.11,6.07) 39.09,6.18 v1(39.09,20.34)
PE0_A2+: length 20.2
  Top Layer w0.299: CN4.A25 42.25,22.38 arc(42.28,22.28) 42.34,22.18 arc(42.4,22.09) 42.42,21.98 42.42,21.8 arc(42.42,21.8) 42.42,21.8 arc(42.42,21.8) 42.42,21.79 v1(42.42,20.34)
  Bottom Layer w0.299: v1(42.42,20.34) 42.42,6.18 arc(42.39,6.07) 42.33,5.98 arc(42.27,5.89) 42.25,5.78 CEMX16_GOLD1.A25
PE0_A2-: length 20.2
  Top Layer w0.299: CN4.A26 43.25,22.38 arc(43.23,22.28) 43.17,22.18 arc(43.11,22.09) 43.09,21.98 43.09,21.53 arc(43.09,21.52) 43.09,21.52 arc(43.09,21.52) 43.09,21.52 v1(43.09,20.34)
  Bottom Layer w0.299: CEMX16_GOLD1.A26 43.25,5.78 arc(43.23,5.89) 43.17,5.98 arc(43.11,6.07) 43.09,6.18 v1(43.09,20.34)
PE0_A3+: length 20.2
  Top Layer w0.299: v1(46.42,20.34) 46.42,21.79 arc(46.42,21.8) 46.42,21.8 arc(46.42,21.8) 46.42,21.8 46.42,21.98 arc(46.4,22.09) 46.34,22.18 arc(46.28,22.28) 46.25,22.38 CN4.A29
  Bottom Layer w0.299: v1(46.41,20.34) 46.41,6.18 arc(46.39,6.07) 46.33,5.98 arc(46.27,5.89) 46.25,5.78 CEMX16_GOLD1.A29
PE0_A3-: length 20.2
  Top Layer w0.299: v1(47.09,20.34) 47.09,21.52 arc(47.09,21.52) 47.09,21.52 arc(47.09,21.52) 47.09,21.53 47.09,21.98 arc(47.11,22.09) 47.17,22.18 arc(47.23,22.28) 47.25,22.38 CN4.A30
  Bottom Layer w0.299: v1(47.09,20.34) 47.09,6.18 arc(47.11,6.07) 47.17,5.98 arc(47.23,5.89) 47.25,5.78 CEMX16_GOLD1.A30
PE0_A4+: length 20.2
  Top Layer w0.299: CN4.A35 52.25,22.38 arc(52.28,22.28) 52.34,22.18 arc(52.4,22.09) 52.42,21.98 52.42,21.8 arc(52.42,21.8) 52.42,21.8 arc(52.42,21.8) 52.41,21.79 v1(52.41,20.34)
  Bottom Layer w0.299: CEMX16_GOLD1.A35 52.25,5.78 arc(52.27,5.89) 52.33,5.98 arc(52.39,6.07) 52.41,6.18 v1(52.41,20.34)
PE0_A4-: length 20.2
  Top Layer w0.299: v1(53.09,20.34) 53.09,21.52 arc(53.09,21.52) 53.09,21.52 arc(53.09,21.52) 53.09,21.53 53.09,21.98 arc(53.11,22.09) 53.17,22.18 arc(53.23,22.28) 53.25,22.38 CN4.A36
  Bottom Layer w0.299: v1(53.09,20.34) 53.09,6.18 arc(53.11,6.07) 53.17,5.98 arc(53.23,5.89) 53.25,5.78 CEMX16_GOLD1.A36
PE0_A5+: length 20.2
  Top Layer w0.299: CN4.A39 56.25,22.38 arc(56.28,22.28) 56.34,22.18 arc(56.4,22.09) 56.42,21.98 56.42,21.8 arc(56.42,21.8) 56.42,21.8 arc(56.42,21.8) 56.41,21.79 v1(56.41,20.31)
  Bottom Layer w0.299: CEMX16_GOLD1.A39 56.25,5.78 arc(56.27,5.89) 56.33,5.98 arc(56.39,6.07) 56.42,6.18 v1(56.42,20.31)
PE0_A5-: length 20.2
  Top Layer w0.299: v1(57.09,20.31) 57.09,21.52 arc(57.09,21.52) 57.09,21.52 arc(57.09,21.52) 57.09,21.53 57.09,21.98 arc(57.11,22.09) 57.17,22.18 arc(57.23,22.28) 57.25,22.38 CN4.A40
  Bottom Layer w0.299: CEMX16_GOLD1.A40 57.25,5.78 arc(57.23,5.89) 57.17,5.98 arc(57.11,6.07) 57.09,6.18 v1(57.09,20.31)
PE0_A6+: length 20.2
  Top Layer w0.299: v1(60.42,20.31) 60.42,21.79 arc(60.42,21.8) 60.42,21.8 arc(60.42,21.8) 60.42,21.8 60.42,21.98 arc(60.4,22.09) 60.34,22.18 arc(60.28,22.28) 60.25,22.38 CN4.A43
  Bottom Layer w0.299: CEMX16_GOLD1.A43 60.25,5.78 arc(60.27,5.89) 60.33,5.98 arc(60.39,6.07) 60.42,6.18 v1(60.42,20.31)
PE0_A6-: length 20.2
  Top Layer w0.299: CN4.A44 61.25,22.38 arc(61.23,22.28) 61.17,22.18 arc(61.11,22.09) 61.09,21.98 61.09,21.53 arc(61.09,21.52) 61.09,21.52 arc(61.09,21.52) 61.09,21.52 v1(61.09,20.31)
  Bottom Layer w0.299: v1(61.09,20.31) 61.09,6.18 arc(61.11,6.07) 61.17,5.98 arc(61.23,5.89) 61.25,5.78 CEMX16_GOLD1.A44
PE0_A7+: length 20.2
  Top Layer w0.299: CN4.A47 64.25,22.38 arc(64.28,22.28) 64.34,22.18 arc(64.4,22.09) 64.42,21.98 64.42,21.8 arc(64.42,21.8) 64.42,21.8 arc(64.42,21.8) 64.41,21.79 v1(64.41,20.31)
  Bottom Layer w0.299: v1(64.42,20.31) 64.42,6.18 arc(64.39,6.07) 64.33,5.98 arc(64.27,5.89) 64.25,5.78 CEMX16_GOLD1.A47
PE0_A7-: length 20.2
  Top Layer w0.299: CN4.A48 65.25,22.38 arc(65.23,22.28) 65.17,22.18 arc(65.11,22.09) 65.09,21.98 65.09,21.53 arc(65.09,21.52) 65.09,21.52 arc(65.09,21.52) 65.09,21.52 v1(65.09,20.31)
  Bottom Layer w0.299: v1(65.09,20.31) 65.09,6.18 arc(65.11,6.07) 65.17,5.98 arc(65.23,5.89) 65.25,5.78 CEMX16_GOLD1.A48
PE0_B0+: length 13
  Top Layer w0.2: CN4.B14 31.25,15.32 arc(31.28,15.18) 31.36,15.06 arc(31.44,14.94) 31.47,14.8 31.47,14.75 arc(31.47,14.75) 31.47,14.75 arc(31.47,14.75) 31.47,14.74 31.47,6.17 arc(31.44,6.03) 31.36,5.91 arc(31.28,5.79) 31.25,5.65 CEMX16_GOLD1.B14
PE0_B0-: length 13
  Top Layer w0.2: CEMX16_GOLD1.B15 32.25,5.65 arc(32.22,5.79) 32.14,5.91 arc(32.06,6.03) 32.03,6.17 32.03,14.51 arc(32.04,14.51) 32.04,14.51 arc(32.04,14.51) 32.04,14.52 32.04,14.8 arc(32.07,14.94) 32.15,15.06 arc(32.23,15.18) 32.25,15.32 CN4.B15
PE0_B1+: length 13
  Top Layer w0.2: CN4.B19 36.25,15.32 arc(36.28,15.18) 36.36,15.06 arc(36.44,14.94) 36.47,14.8 36.47,14.75 arc(36.47,14.75) 36.47,14.75 arc(36.47,14.75) 36.47,14.74 36.47,6.17 arc(36.44,6.03) 36.36,5.91 arc(36.28,5.79) 36.25,5.65 CEMX16_GOLD1.B19
PE0_B1-: length 13
  Top Layer w0.2: CEMX16_GOLD1.B20 37.25,5.65 arc(37.22,5.79) 37.14,5.91 arc(37.06,6.03) 37.03,6.17 37.03,14.51 arc(37.04,14.51) 37.04,14.51 arc(37.04,14.51) 37.04,14.52 37.04,14.8 arc(37.07,14.94) 37.15,15.06 arc(37.23,15.18) 37.25,15.32 CN4.B20
PE0_B2+: length 13
  Top Layer w0.2: CEMX16_GOLD1.B23 40.25,5.65 arc(40.28,5.79) 40.36,5.91 arc(40.44,6.03) 40.47,6.17 40.47,14.74 arc(40.47,14.75) 40.47,14.75 arc(40.47,14.75) 40.47,14.75 40.47,14.8 arc(40.44,14.94) 40.36,15.06 arc(40.28,15.18) 40.25,15.32 CN4.B23
PE0_B2-: length 13
  Top Layer w0.2: CEMX16_GOLD1.B24 41.25,5.65 arc(41.22,5.79) 41.14,5.91 arc(41.06,6.03) 41.04,6.17 41.04,14.51 arc(41.04,14.51) 41.04,14.51 arc(41.04,14.51) 41.04,14.52 41.04,14.8 arc(41.07,14.94) 41.15,15.06 arc(41.23,15.18) 41.25,15.32 CN4.B24
PE0_B3+: length 13
  Top Layer w0.2: CEMX16_GOLD1.B27 44.25,5.65 arc(44.28,5.79) 44.36,5.91 arc(44.44,6.03) 44.47,6.17 44.47,14.74 arc(44.47,14.75) 44.47,14.75 arc(44.47,14.75) 44.47,14.75 44.47,14.8 arc(44.44,14.94) 44.36,15.06 arc(44.28,15.18) 44.25,15.32 CN4.B27
PE0_B3-: length 13
  Top Layer w0.2: CEMX16_GOLD1.B28 45.25,5.65 arc(45.22,5.79) 45.14,5.91 arc(45.06,6.03) 45.03,6.17 45.03,14.51 arc(45.04,14.51) 45.04,14.51 arc(45.04,14.51) 45.04,14.52 45.04,14.8 arc(45.07,14.94) 45.15,15.06 arc(45.23,15.18) 45.25,15.32 CN4.B28
PE0_B4+: length 13
  Top Layer w0.2: CN4.B33 50.25,15.32 arc(50.28,15.18) 50.36,15.06 arc(50.44,14.94) 50.47,14.8 50.47,14.75 arc(50.47,14.75) 50.47,14.75 arc(50.47,14.75) 50.47,14.74 50.47,6.17 arc(50.44,6.03) 50.36,5.91 arc(50.28,5.79) 50.25,5.65 CEMX16_GOLD1.B33
PE0_B4-: length 13
  Top Layer w0.2: CN4.B34 51.25,15.32 arc(51.23,15.18) 51.15,15.06 arc(51.07,14.94) 51.04,14.8 51.04,14.52 arc(51.04,14.51) 51.04,14.51 arc(51.04,14.51) 51.03,14.51 51.03,6.17 arc(51.06,6.03) 51.14,5.91 arc(51.22,5.79) 51.25,5.65 CEMX16_GOLD1.B34
PE0_B5+: length 13
  Top Layer w0.2: CN4.B37 54.25,15.32 arc(54.28,15.18) 54.36,15.06 arc(54.44,14.94) 54.47,14.8 54.47,14.75 arc(54.47,14.75) 54.47,14.75 arc(54.47,14.75) 54.47,14.74 54.47,6.17 arc(54.44,6.03) 54.36,5.91 arc(54.28,5.79) 54.25,5.65 CEMX16_GOLD1.B37
PE0_B5-: length 13
  Top Layer w0.2: CN4.B38 55.25,15.32 arc(55.23,15.18) 55.15,15.06 arc(55.07,14.94) 55.04,14.8 55.04,14.52 arc(55.04,14.51) 55.04,14.51 arc(55.04,14.51) 55.03,14.51 55.03,6.17 arc(55.06,6.03) 55.14,5.91 arc(55.22,5.79) 55.25,5.65 CEMX16_GOLD1.B38
PE0_B6+: length 13
  Top Layer w0.2: CN4.B41 58.25,15.32 arc(58.28,15.18) 58.36,15.06 arc(58.44,14.94) 58.47,14.8 58.47,14.75 arc(58.47,14.75) 58.47,14.75 arc(58.47,14.75) 58.47,14.74 58.47,6.17 arc(58.44,6.03) 58.36,5.91 arc(58.28,5.79) 58.25,5.65 CEMX16_GOLD1.B41
PE0_B6-: length 13
  Top Layer w0.2: CN4.B42 59.25,15.32 arc(59.23,15.18) 59.15,15.06 arc(59.07,14.94) 59.04,14.8 59.04,14.52 arc(59.04,14.51) 59.04,14.51 arc(59.04,14.51) 59.04,14.51 59.04,6.17 arc(59.06,6.03) 59.14,5.91 arc(59.22,5.79) 59.25,5.65 CEMX16_GOLD1.B42
PE0_B7+: length 13
  Top Layer w0.2: CEMX16_GOLD1.B45 62.25,5.65 arc(62.28,5.79) 62.36,5.91 arc(62.44,6.03) 62.47,6.17 62.47,14.74 arc(62.47,14.75) 62.47,14.75 arc(62.47,14.75) 62.47,14.75 62.47,14.8 arc(62.44,14.94) 62.36,15.06 arc(62.28,15.18) 62.25,15.32 CN4.B45
PE0_B7-: length 13
  Top Layer w0.2: CN4.B46 63.25,15.32 arc(63.23,15.18) 63.15,15.06 arc(63.07,14.94) 63.04,14.8 63.04,14.52 arc(63.04,14.51) 63.04,14.51 arc(63.04,14.51) 63.03,14.51 63.03,6.17 arc(63.06,6.03) 63.14,5.91 arc(63.22,5.79) 63.25,5.65 CEMX16_GOLD1.B46
PE0_CLK+: length 32.5
  Top Layer w0.2: v1(30.42,21.16) 30.42,23.16 arc(30.38,23.38) CN4.A13 ; v1(15.63,28.36) 14.19,28.36 arc(14.18,28.36) 14.18,28.36 arc(14.18,28.36) 14.18,28.36 R39.2 arc(13.69,28.35) 13.68,28.35 R47.2
  Bottom Layer w0.2: v1(15.63,28.36) 15.63,19.55 arc(15.78,18.8) 16.2,18.16 16.65,17.72 arc(17.29,17.29) 18.04,17.14 26.33,17.14 arc(27.08,17.29) 27.72,17.72 29.9,19.89 arc(30.29,20.48) v1(30.42,21.16)
PE0_CLK-: length 32.6
  Top Layer w0.2: R48.2 13.68,27.2 arc(13.69,27.2) R40.2 14.98,27.19 arc(15.02,27.18) v1(15.05,27.16) ; v1(31.08,21.16) 31.08,23.16 arc(31.13,23.38) CN4.A14
  Bottom Layer w0.2: v1(31.08,21.16) 31.08,20.58 arc(31.03,20.3) 30.87,20.06 28.12,17.31 arc(27.3,16.76) 26.33,16.57 18.04,16.57 arc(17.07,16.76) 16.25,17.31 15.8,17.76 arc(15.25,18.58) 15.06,19.55 15.06,27.16 v1(15.05,27.16)
PE1_A0+: length 74.4
  Top Layer w0.2: v1(33.4,40.74) 33.4,43.53 arc(33.36,43.72) CN5.A16
  Bottom Layer w0.299: v1(33.4,40.74) 33.4,34.77 arc(33.6,33.79) 34.15,32.97 41.13,25.98 arc(41.96,25.43) 42.93,25.24 70.03,25.24 arc(70.75,25.1) 71.35,24.69 71.91,24.14 arc(72.31,23.53) 72.45,22.81 72.45,12.77 arc(72.37,12.35) 72.13,11.99 70.16,10.02 arc(69.61,9.19) 69.41,8.22 69.41,6.18 arc(69.39,6.07) 69.33,5.98 arc(69.27,5.89) 69.25,5.78 CEMX16_GOLD1.A52
PE1_A0-: length 74.4
  Top Layer w0.2: v1(34.07,40.74) 34.07,43.44 arc(34.12,43.68) CN5.A17
  Bottom Layer w0.299: CEMX16_GOLD1.A53 70.25,5.78 arc(70.23,5.89) 70.17,5.98 arc(70.11,6.07) 70.09,6.18 70.09,8.22 arc(70.23,8.94) 70.63,9.54 72.6,11.51 arc(72.99,12.09) 73.12,12.77 73.12,22.81 arc(72.93,23.79) 72.38,24.61 71.83,25.16 arc(71,25.71) 70.03,25.91 42.93,25.91 arc(42.21,26.05) 41.61,26.46 34.62,33.44 arc(34.21,34.05) 34.07,34.77 v1(34.07,40.74)
PE1_A1+: length 72
  Top Layer w0.299: v1(38.38,40.74) 38.38,43.59 arc(38.35,43.75) CN5.A21
  Bottom Layer w0.299: CEMX16_GOLD1.A56 73.25,5.78 arc(73.27,5.89) 73.33,5.98 arc(73.39,6.07) 73.42,6.18 73.42,9.77 arc(73.61,10.74) 74.16,11.57 74.5,11.91 arc(74.69,12.19) 74.75,12.52 74.75,24.05 arc(74.61,24.76) 74.21,25.36 73.15,26.41 arc(72.79,26.65) 72.37,26.74 46.03,26.74 arc(45.06,26.93) 44.23,27.48 39.12,32.6 arc(38.57,33.42) 38.38,34.39 v1(38.38,40.74)
PE1_A1-: length 72
  Top Layer w0.2: v1(39.05,40.74) 39.05,43.39 arc(39.1,43.66) CN5.A22
  Bottom Layer w0.299: CEMX16_GOLD1.A57 74.25,5.78 arc(74.23,5.89) 74.17,5.98 arc(74.11,6.07) 74.09,6.18 74.09,9.77 arc(74.23,10.49) 74.63,11.09 74.98,11.44 arc(75.31,11.93) 75.42,12.52 75.42,24.05 arc(75.23,25.01) 74.69,25.83 73.63,26.89 arc(73.05,27.27) 72.37,27.41 46.03,27.41 arc(45.31,27.55) 44.71,27.96 39.6,33.07 arc(39.19,33.68) 39.05,34.39 v1(39.05,40.74)
PE1_A2+: length 70.8
  Top Layer w0.2: v1(42.4,40.74) 42.4,43.53 arc(42.36,43.72) CN5.A25
  Bottom Layer w0.299: v1(42.4,40.74) 42.4,33.67 arc(42.6,32.69) 43.15,31.87 46.41,28.61 arc(47.23,28.06) 48.21,27.86 73.9,27.86 arc(74.62,27.72) 75.23,27.32 76.87,25.68 arc(77.27,25.07) 77.42,24.35 77.42,6.18 arc(77.39,6.07) 77.33,5.98 arc(77.27,5.89) 77.25,5.78 CEMX16_GOLD1.A60
PE1_A2-: length 70.8
  Top Layer w0.2: v1(43.07,40.74) 43.07,43.45 arc(43.12,43.68) CN5.A26
  Bottom Layer w0.299: v1(43.07,40.74) 43.07,33.67 arc(43.21,32.95) 43.62,32.34 46.88,29.08 arc(47.49,28.68) 48.21,28.53 73.9,28.53 arc(74.88,28.34) 75.7,27.79 77.34,26.15 arc(77.89,25.33) 78.09,24.35 78.09,6.18 arc(78.11,6.07) 78.17,5.98 arc(78.23,5.89) 78.25,5.78 CEMX16_GOLD1.A61
PE1_A3+: length 70.2
  Top Layer w0.2: v1(46.5,40.71) 46.5,43.29 arc(46.44,43.61) CN5.A29
  Bottom Layer w0.299: CEMX16_GOLD1.A64 81.25,5.78 arc(81.27,5.89) 81.33,5.98 arc(81.39,6.07) 81.41,6.18 81.41,24.25 arc(81.27,24.97) 80.87,25.58 77.83,28.62 arc(77.22,29.02) 76.5,29.16 51.68,29.16 arc(50.71,29.36) 49.88,29.91 47.25,32.55 arc(46.7,33.37) 46.5,34.34 v1(46.5,40.71)
PE1_A3-: length 70.2
  Top Layer w0.2: v1(47.17,40.71) 47.17,43.69 arc(47.19,43.79) CN5.A30
  Bottom Layer w0.299: v1(47.17,40.71) 47.17,34.34 arc(47.32,33.63) 47.72,33.02 50.36,30.38 arc(50.96,29.98) 51.68,29.83 76.5,29.83 arc(77.48,29.64) 78.3,29.09 81.34,26.05 arc(81.89,25.23) 82.09,24.25 82.09,6.18 arc(82.11,6.07) 82.17,5.98 arc(82.23,5.89) 82.25,5.78 CEMX16_GOLD1.A65
PE1_A4+: length 66.7
  Top Layer w0.2: v1(52.43,40.71) 52.43,43.47 arc(52.38,43.69) CN5.A35
  Bottom Layer w0.299: v1(52.43,40.71) 52.43,35.07 arc(52.62,34.09) 53.17,33.27 55.18,31.26 arc(56.01,30.71) 56.98,30.51 77.13,30.51 arc(77.85,30.37) 78.45,29.97 84.87,23.55 arc(85.27,22.94) 85.42,22.23 85.42,6.18 arc(85.39,6.07) 85.33,5.98 arc(85.27,5.89) 85.25,5.78 CEMX16_GOLD1.A68
PE1_A4-: length 66.7
  Top Layer w0.2: v1(53.1,40.71) 53.1,43.51 arc(53.14,43.71) CN5.A36
  Bottom Layer w0.299: v1(53.1,40.71) 53.1,35.07 arc(53.24,34.35) 53.65,33.74 55.66,31.73 arc(56.26,31.33) 56.98,31.18 77.13,31.18 arc(78.1,30.99) 78.93,30.44 85.34,24.02 arc(85.89,23.2) 86.09,22.23 86.09,6.18 arc(86.11,6.07) 86.17,5.98 arc(86.23,5.89) 86.25,5.78 CEMX16_GOLD1.A69
PE1_A5+: length 66.3
  Top Layer w0.2: v1(56.4,40.69) 56.4,43.53 arc(56.36,43.72) CN5.A39
  Bottom Layer w0.299: v1(56.4,40.69) 56.4,35.34 arc(56.6,34.37) 57.15,33.55 57.86,32.83 arc(58.68,32.28) 59.66,32.09 79.1,32.09 arc(79.82,31.95) 80.43,31.54 88.87,23.1 arc(89.27,22.49) 89.41,21.78 89.41,6.18 arc(89.39,6.07) 89.33,5.98 arc(89.27,5.89) 89.25,5.78 CEMX16_GOLD1.A72
PE1_A5-: length 66.3
  Top Layer w0.2: v1(57.07,40.69) 57.07,43.45 arc(57.12,43.68) CN5.A40
  Bottom Layer w0.299: v1(57.07,40.69) 57.07,35.34 arc(57.22,34.63) 57.62,34.02 58.33,33.31 arc(58.94,32.9) 59.66,32.76 79.11,32.76 arc(80.08,32.57) 80.9,32.01 89.34,23.57 arc(89.89,22.75) 90.09,21.78 90.09,6.18 arc(90.11,6.07) 90.17,5.98 arc(90.23,5.89) 90.25,5.78 CEMX16_GOLD1.A73
PE1_A6+: length 65.8
  Top Layer w0.2: v1(60.48,40.66) 60.48,43.35 arc(60.42,43.64) CN5.A43
  Bottom Layer w0.299: CEMX16_GOLD1.A76 93.25,5.78 arc(93.27,5.89) 93.33,5.98 arc(93.39,6.07) 93.41,6.18 93.41,22.15 arc(93.27,22.87) 92.87,23.48 83.5,32.84 arc(82.9,33.25) 82.18,33.39 63.53,33.39 arc(62.56,33.58) 61.73,34.13 61.1,34.76 arc(60.64,35.46) 60.48,36.27 v1(60.48,40.66)
PE1_A6-: length 65.8
  Top Layer w0.2: v1(61.15,40.66) 61.15,43.63 arc(61.18,43.77) CN5.A44
  Bottom Layer w0.299: CEMX16_GOLD1.A77 94.25,5.78 arc(94.23,5.89) 94.17,5.98 arc(94.11,6.07) 94.09,6.18 94.09,22.15 arc(93.89,23.13) 93.34,23.95 83.98,33.31 arc(83.15,33.87) 82.18,34.06 63.53,34.06 arc(62.81,34.2) 62.21,34.61 61.58,35.24 arc(61.26,35.71) 61.15,36.27 v1(61.15,40.66)
PE1_A7+: length 65.4
  Top Layer w0.2: v1(64.43,40.64) 64.43,43.47 arc(64.38,43.69) CN5.A47
  Bottom Layer w0.299: v1(64.43,40.64) 64.43,36.99 arc(64.58,36.2) 65.03,35.54 65.36,35.21 arc(66.18,34.66) 67.16,34.46 85.08,34.46 arc(85.8,34.32) 86.4,33.92 96.87,23.45 arc(97.27,22.84) 97.41,22.13 97.41,6.18 arc(97.39,6.07) 97.33,5.98 arc(97.27,5.89) 97.25,5.78 CEMX16_GOLD1.A80
PE1_A7-: length 65.4
  Top Layer w0.2: v1(65.1,40.64) 65.1,43.51 arc(65.14,43.71) CN5.A48
  Bottom Layer w0.299: v1(65.1,40.64) 65.1,36.99 arc(65.2,36.46) 65.5,36.01 65.83,35.68 arc(66.44,35.28) 67.16,35.13 85.08,35.13 arc(86.05,34.94) 86.88,34.39 97.34,23.93 arc(97.89,23.1) 98.09,22.13 98.09,6.18 arc(98.11,6.07) 98.17,5.98 arc(98.23,5.89) 98.25,5.78 CEMX16_GOLD1.A81
PE1_B0+: length 72.1
  Top Layer w0.2: CEMX16_GOLD1.B50 67.25,5.65 arc(67.28,5.79) 67.36,5.91 arc(67.44,6.03) 67.47,6.17 67.47,9.3 arc(67.66,10.27) 68.21,11.09 71.58,14.46 arc(72,15.1) 72.15,15.85 72.15,23.17 arc(72,23.93) 71.58,24.57 71.14,25 arc(70.82,25.21) 70.45,25.29 36.85,25.29 arc(35.88,25.48) 35.06,26.03 32.2,28.89 arc(31.65,29.72) 31.45,30.69 31.45,36.11 arc(31.43,36.24) 31.35,36.35 arc(31.28,36.46) 31.25,36.59 CN5.B14
PE1_B0-: length 72.1
  Top Layer w0.2: CEMX16_GOLD1.B51 68.25,5.65 arc(68.22,5.79) 68.14,5.91 arc(68.06,6.03) 68.03,6.17 68.03,9.3 arc(68.18,10.05) 68.61,10.69 71.98,14.06 arc(72.53,14.88) 72.72,15.85 72.72,23.17 arc(72.53,24.14) 71.98,24.97 71.54,25.41 arc(71.04,25.74) 70.45,25.86 36.85,25.86 arc(36.1,26.01) 35.46,26.44 32.6,29.3 arc(32.17,29.94) 32.02,30.69 32.02,36.05 arc(32.05,36.2) 32.14,36.33 arc(32.22,36.46) 32.25,36.61 CN5.B15
PE1_B1+: length 66.8
  Top Layer w0.2: CEMX16_GOLD1.B54 71.25,5.65 arc(71.28,5.79) 71.36,5.91 arc(71.44,6.03) 71.47,6.17 71.47,10.87 arc(71.66,11.84) 72.21,12.67 73.55,14.01 arc(73.98,14.65) 74.13,15.4 74.13,23.5 arc(73.98,24.25) 73.55,24.89 72.43,26.01 arc(71.79,26.44) 71.04,26.59 43.38,26.59 arc(42.41,26.78) 41.58,27.33 37.22,31.7 arc(36.67,32.52) 36.48,33.49 36.48,36.07 arc(36.45,36.21) 36.37,36.34 arc(36.28,36.46) 36.25,36.61 CN5.B19
PE1_B1-: length 66.8
  Top Layer w0.2: CEMX16_GOLD1.B55 72.25,5.65 arc(72.22,5.79) 72.14,5.91 arc(72.06,6.03) 72.03,6.17 72.03,10.87 arc(72.18,11.63) 72.61,12.26 73.95,13.61 arc(74.51,14.43) 74.7,15.4 74.7,23.5 arc(74.51,24.47) 73.95,25.29 72.83,26.41 arc(72.01,26.97) 71.04,27.16 43.38,27.16 arc(42.63,27.31) 41.99,27.74 37.62,32.1 arc(37.2,32.74) 37.05,33.49 37.05,36.1 arc(37.07,36.23) 37.15,36.35 arc(37.23,36.46) 37.25,36.6 CN5.B20
PE1_B2+: length 65.6
  Top Layer w0.2: CEMX16_GOLD1.B58 75.25,5.65 arc(75.28,5.79) 75.36,5.91 arc(75.44,6.03) 75.47,6.17 75.47,12.97 arc(75.66,13.94) 76.21,14.77 76.39,14.95 arc(76.59,15.24) 76.65,15.58 76.65,24.32 arc(76.5,25.08) 76.08,25.72 74.63,27.16 arc(73.99,27.59) 73.24,27.74 45.48,27.74 arc(44.51,27.93) 43.68,28.48 41.27,30.89 arc(40.72,31.72) 40.53,32.69 40.53,36.03 arc(40.46,36.38) CN5.B23
PE1_B2-: length 65.6
  Top Layer w0.2: CN5.B24 41.25,35.49 arc(41.23,35.38) 41.18,35.3 arc(41.12,35.21) 41.1,35.11 41.1,32.69 arc(41.25,31.94) 41.67,31.3 44.09,28.89 arc(44.73,28.46) 45.48,28.31 73.24,28.31 arc(74.21,28.12) 75.03,27.56 76.48,26.12 arc(77.03,25.29) 77.22,24.32 77.22,15.58 arc(77.11,15.02) 76.8,14.55 76.61,14.36 arc(76.18,13.73) 76.04,12.97 76.04,6.17 arc(76.06,6.03) 76.14,5.91 arc(76.22,5.79) 76.25,5.65 CEMX16_GOLD1.B59
PE1_B3+: length 63.5
  Top Layer w0.2: CEMX16_GOLD1.B62 79.25,5.65 arc(79.28,5.79) 79.36,5.91 arc(79.44,6.03) 79.47,6.17 79.47,24.46 arc(79.32,25.22) 78.89,25.86 76.21,28.54 arc(75.57,28.96) 74.81,29.11 49.36,29.11 arc(48.38,29.31) 47.56,29.86 45.22,32.2 arc(44.67,33.02) 44.48,33.99 44.48,35.1 arc(44.45,35.25) 44.37,35.37 arc(44.28,35.5) 44.25,35.64 CN5.B27
PE1_B3-: length 63.5
  Top Layer w0.2: CN5.B28 45.25,35.49 arc(45.23,35.35) 45.15,35.24 arc(45.07,35.12) 45.05,34.99 45.05,33.99 arc(45.2,33.24) 45.62,32.6 47.96,30.26 arc(48.6,29.83) 49.35,29.68 74.81,29.68 arc(75.79,29.49) 76.61,28.94 79.29,26.26 arc(79.84,25.43) 80.03,24.46 80.03,6.17 arc(80.06,6.03) 80.14,5.91 arc(80.22,5.79) 80.25,5.65 CEMX16_GOLD1.B63
PE1_B4+: length 60
  Top Layer w0.2: CN5.B33 50.25,36.16 arc(50.45,35.19) 51,34.37 54.13,31.23 arc(54.96,30.68) 55.93,30.49 76.79,30.49 arc(77.54,30.34) 78.18,29.91 82.89,25.21 arc(83.32,24.57) 83.47,23.81 83.47,6.17 arc(83.44,6.03) 83.36,5.91 arc(83.28,5.79) 83.25,5.65 CEMX16_GOLD1.B66
PE1_B4-: length 59.8
  Top Layer w0.2: CN5.B34 51.25,35.27 arc(51.32,34.95) 51.51,34.67 54.54,31.64 arc(55.18,31.21) 55.93,31.06 76.79,31.06 arc(77.76,30.87) 78.58,30.31 83.29,25.61 arc(83.84,24.78) 84.03,23.81 84.03,6.17 arc(84.06,6.03) 84.14,5.91 arc(84.22,5.79) 84.25,5.65 CEMX16_GOLD1.B67
PE1_B5+: length 60.2
  Top Layer w0.2: CEMX16_GOLD1.B70 87.25,5.65 arc(87.28,5.79) 87.36,5.91 arc(87.44,6.03) 87.47,6.17 87.47,24.04 arc(87.32,24.79) 86.89,25.43 80.93,31.39 arc(80.29,31.81) 79.54,31.96 58.26,31.96 arc(57.28,32.16) 56.46,32.71 55,34.17 arc(54.45,34.99) 54.25,35.96 CN5.B37
PE1_B5-: length 60.1
  Top Layer w0.2: CEMX16_GOLD1.B71 88.25,5.65 arc(88.22,5.79) 88.14,5.91 arc(88.06,6.03) 88.03,6.17 88.03,24.04 arc(87.84,25.01) 87.29,25.83 81.33,31.79 arc(80.51,32.34) 79.54,32.53 58.26,32.53 arc(57.5,32.68) 56.86,33.11 55.51,34.47 arc(55.32,34.75) 55.25,35.07 CN5.B38
PE1_B6+: length 60.5
  Top Layer w0.2: CEMX16_GOLD1.B74 91.25,5.65 arc(91.28,5.79) 91.36,5.91 arc(91.44,6.03) 91.47,6.17 91.47,24.14 arc(91.32,24.89) 90.89,25.53 83.71,32.71 arc(83.07,33.14) 82.31,33.29 60.47,33.29 arc(59.62,33.46) 58.9,33.94 arc(58.42,34.66) 58.25,35.51 CN5.B41
PE1_B6-: length 60.5
  Top Layer w0.2: CN5.B42 59.25,35.24 arc(59.36,34.68) 59.68,34.21 arc(60.07,33.95) 60.54,33.86 82.31,33.86 arc(83.29,33.67) 84.11,33.12 91.29,25.93 arc(91.84,25.11) 92.04,24.14 92.04,7.69 arc(92.07,7.6) 92.16,7.57 arc(92.25,7.53) 92.29,7.44 92.29,7.09 arc(92.25,7) 92.16,6.97 arc(92.07,6.93) 92.04,6.84 92.04,6.17 arc(92.06,6.03) 92.14,5.91 arc(92.22,5.79) 92.25,5.65 CEMX16_GOLD1.B75
PE1_B7+: length 59.9
  Top Layer w0.2: CEMX16_GOLD1.B78 95.25,5.65 arc(95.28,5.79) 95.36,5.91 arc(95.44,6.03) 95.47,6.17 95.47,24.16 arc(95.32,24.92) 94.89,25.56 86.36,34.09 arc(85.72,34.51) 84.96,34.66 63.71,34.66 arc(63.29,34.75) 62.93,34.99 ; CN5.B45 62.25,36.62 arc(62.43,35.74) 62.93,34.99
PE1_B7-: length 59.8
  Top Layer w0.2: CN5.B46 63.25,35.69 arc(63.29,35.53) 63.38,35.39 arc(63.55,35.27) 63.75,35.23 84.96,35.23 arc(85.94,35.04) 86.76,34.49 95.29,25.96 arc(95.84,25.13) 96.04,24.16 96.04,6.17 arc(96.06,6.03) 96.14,5.91 arc(96.22,5.79) 96.25,5.65 CEMX16_GOLD1.B79
PE1_CLK+: length 28.3
  Top Layer w0.2: R45.2 13.68,32.6 arc(13.69,32.61) R37.2 arc(13.99,32.43) 14.32,32.36 v1(15.53,32.36) ; CN5.A13 30.25,42.79 arc(30.27,42.69) 30.33,42.61 arc(30.39,42.52) 30.41,42.43 v1(30.41,41.24)
  Bottom Layer w0.2: v1(30.41,41.24) arc(30.44,41.19) 30.45,41.13 30.45,40.42 arc(30.41,40.33) 30.33,40.3 arc(30.24,40.26) 30.2,40.17 30.2,39.82 arc(30.24,39.73) 30.33,39.7 arc(30.41,39.66) 30.45,39.57 30.45,39.22 arc(30.41,39.13) 30.33,39.1 arc(30.24,39.06) 30.2,38.97 30.2,38.62 arc(30.24,38.53) 30.33,38.5 arc(30.41,38.46) 30.45,38.37 30.45,38.02 arc(30.41,37.93) 30.33,37.9 arc(30.24,37.86) 30.2,37.77 30.2,37.42 arc(30.24,37.33) 30.33,37.3 arc(30.41,37.26) 30.45,37.17 30.45,36.78 arc(30.3,36.03) 29.88,35.39 27.38,32.89 arc(26.74,32.47) 25.99,32.32 15.63,32.32 arc(15.58,32.33) v1(15.53,32.36)
PE1_CLK-: length 28.3
  Top Layer w0.2: CN5.A14 31.25,42.82 arc(31.23,42.7) 31.16,42.59 arc(31.09,42.49) 31.07,42.37 v1(31.07,41.24) ; v1(15.53,31.7) 14.32,31.7 arc(13.99,31.63) R38.2 arc(13.69,31.46) 13.68,31.46 R46.2
  Bottom Layer w0.2: v1(31.07,41.24) arc(31.03,41.19) 31.02,41.13 31.02,36.78 arc(30.83,35.81) 30.28,34.98 27.78,32.49 arc(26.96,31.94) 25.99,31.75 15.63,31.75 arc(15.58,31.73) v1(15.53,31.7)
PERST#: length 44.5
  Top Layer w0.127: v1(26.29,40.84) 26.29,43.85 CN5.A11 ; v1(26.25,20.52) CN4.A11
  Inner2 w0.127: v1(26.93,9.73) 26.25,10.4 v1(26.25,20.52) 26.25,24.42 26.88,25.05 26.88,34.93 26.29,35.51 v1(26.29,40.84)
  Bottom Layer w0.127: CEMX16_GOLD1.A11 26.25,9.05 v1(26.93,9.73)
REFCLK+: length 41
  Top Layer w0.2: v1(7.26,25.21) 7.26,27.24 arc(7.27,27.33) U1.14
  Bottom Layer w0.2: CEMX16_GOLD1.A13 30.25,5.65 arc(30.28,5.79) 30.36,5.91 arc(30.44,6.03) 30.47,6.17 30.47,11.11 arc(30.32,11.86) 29.89,12.5 27.5,14.89 arc(26.86,15.31) 26.11,15.46 14.7,15.46 arc(13.73,15.66) 12.91,16.21 8.07,21.04 arc(7.52,21.87) 7.33,22.84 7.33,25.05 arc(7.31,25.14) v1(7.26,25.21)
REFCLK-: length 40.9
  Top Layer w0.2: v1(7.93,25.21) 7.93,27.16 arc(7.92,27.24) 7.89,27.32
  Bottom Layer w0.2: CEMX16_GOLD1.A14 31.25,5.65 arc(31.22,5.79) 31.14,5.91 arc(31.06,6.03) 31.04,6.17 31.04,11.11 arc(30.84,12.08) 30.29,12.9 27.91,15.29 arc(27.08,15.84) 26.11,16.03 14.7,16.03 arc(13.95,16.18) 13.31,16.61 8.47,21.45 arc(8.05,22.09) 7.9,22.84 7.9,25.14 arc(7.9,25.18) v1(7.93,25.21)
SMCLK: length 13
  Top Layer w0.299: CN4.B5 20.25,15.18 arc(20.28,15.07) 20.34,14.98 arc(20.4,14.89) 20.42,14.78 20.42,14.6 arc(20.42,14.6) 20.42,14.6 arc(20.42,14.6) 20.42,14.59 20.42,6.18 arc(20.39,6.07) 20.33,5.98 arc(20.27,5.89) 20.25,5.78 CEMX16_GOLD1.B5
SMDAT: length 13
  Top Layer w0.299: CEMX16_GOLD1.B6 21.25,5.78 arc(21.23,5.89) 21.17,5.98 arc(21.11,6.07) 21.09,6.18 21.09,14.32 arc(21.09,14.32) 21.09,14.32 arc(21.09,14.32) 21.09,14.33 21.09,14.78 arc(21.11,14.89) 21.17,14.98 arc(21.23,15.07) 21.25,15.18 CN4.B6
WAKE#: length 42.4
  Top Layer w0.127: CN5.B11 26.25,38.14 v1(26.93,38.81) ; CEMX16_GOLD1.B11 26.17,3.54 26.17,16.28 CN4.B11 26.25,14.98 v1(26.8,14.43)
  Inner2 w0.127: v1(26.8,14.43) 26.8,23.96 27.44,24.59 27.44,35.26 26.93,35.76 v1(26.93,38.81)
$2N1172: length 3.3
  Top Layer w0.2: R46.1 10.66,30.54 arc(10.05,30.13) 9.32,29.99 8.84,29.99
$2N1173: length 2.8
  Top Layer w0.2: 8.98,29.13 9.74,29.13 arc(10.71,28.94) 11.53,28.39 R47.1
$2N1174: length 3
  Top Layer w0.2: U1.18 9.16,28.56 arc(10.14,28.37) 10.96,27.82 R48.1
$2N1181: length 39.6
  Top Layer w0.28: C70.2 4.83,33.57 U1.32 ; U1.2 2.59,31.06 v1(2.53,31) ; v1(2.53,29.48) 2.61,29.56 U1.5 ; U1.23 9.65,31.06 9.78,31.19 v1(9.78,33.7) ; v1(11.25,29.9) 10.91,29.56 U1.20 ; U1.30 5.83,33.68 v1(5.85,33.7) ; v1(6.99,33.7) 6.82,33.53 U1.28 ; v1(5.17,25.99) 5.33,26.14 U1.10
  Bottom Layer w0.686: 6.47,33.18 v1(6.99,33.7) ; 6.47,33.18 5.33,33.18 ; 6.47,33.18 9.27,33.18 ; v1(5.17,25.99) 2.75,25.99 ; 2.75,25.99 2.95,25.78 v1(2.95,24.3) 2.95,23.63 v1(2.93,23.61) ; 2.75,25.99 v1(2.68,26.05) v1(2.68,27.83) 2.68,29.32 v1(2.53,29.48) v1(2.53,31) 4.7,33.18 ; 9.27,33.18 v1(9.78,33.7) ; 9.27,33.18 11.25,31.2 v1(11.25,29.9) ; 5.33,33.18 v1(5.85,33.7) ; 5.33,33.18 4.7,33.18 ; 4.7,33.18 v1(4.7,33.73)
$2N8038: length 3.5
  Top Layer w0.2: U1.22 9.13,30.56 arc(9.66,30.67) 10.1,30.96 11.46,32.32 arc(11.54,32.45) R45.1

## Copper pours and planes (outline as drawn; the poured copper is in the pictures)
GND on Top Layer: 109.78,3.46 109.78,52.91 -6.73,52.91 -6.73,19.72 0.53,8.04 12.07,8.04 13.8,3.46
GND on Bottom Layer: -6.73,19.72 0.53,8.04 12.07,8.04 13.8,3.46 109.26,3.46 109.26,52.91 -6.73,52.91
GND on Inner1: -5.84,53.29 110.37,53.29 110.37,1.32 -5.84,1.32
GND on Inner2: -6.73,52.91 109.48,52.91 109.48,1.32 -6.73,1.32
P3V3_1 on Top Layer: 23.61,17.35 25.66,19.4 25.66,25.11 26.36,25.81 26.36,31.76 26.23,31.89 25.98,31.89 24.39,33.48 24.39,34.88 23.63,35.64 23.63,37.69 25.66,39.73 25.66,44.91 25.53,45.04 23.97,45.04 23.75,44.82 23.75,42.88 22.87,41.99 22.87,25.6 23.88,24.59 23.88,22.56 22.87,21.54 22.87,3.46 23.58,3.46 23.63,3.51 23.63,5.67 23.75,5.79 24.63,5.79 24.76,5.92 24.76,14.19 23.63,15.32 23.63,17.33
P3V3_1 on Bottom Layer: 23.91,3.46 25.6,3.46 25.6,8.13 24.26,9.48 23.12,9.48 22.87,9.22 22.87,6.64 23.91,5.6
P3V3_1 on Inner1: 25.66,42.37 22.87,42.37 22.87,6.3 24.76,6.3 24.76,18.48 25.67,19.4 25.67,32.19 24.39,33.47 24.39,38.43 25.66,39.7
P3V3_1 on Inner2: 25.66,14.56 25.66,42.41 22.87,42.41 22.87,6.3 24.76,6.3 24.76,13.65
